# Altium schematic sheet Encoder.SchDoc: Encoder Expansion Board
size Letter; Engineer: Will Knutson; Revision: A; SheetNumber: 1; SheetTotal: 1; ProjectGroup: Severson Group; ProjectOrganization: WEMPEC; ProjectUniversity: UW-Madison; ProjectRev: A
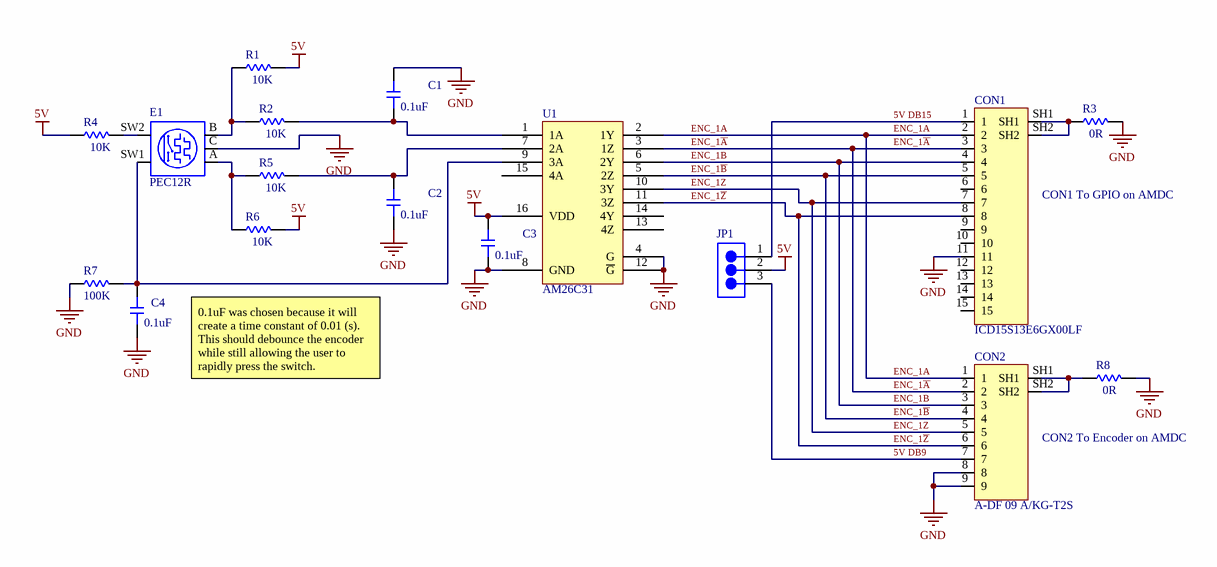
[diagram p0: Encoder.SchDoc]

## Parts
C1  Capacitor 0.1uF  [.1uF Capacitor (0603-CAP)]  (value not drawn)
C2  Capacitor 0.1uF  [.1uF Capacitor (0603-CAP)]  (value not drawn)
C3  Capacitor 0.1uF  [.1uF Capacitor (0603-CAP)]  (value not drawn)
C4  Capacitor 0.1uF  [.1uF Capacitor (0603-CAP)]  (value not drawn)
CON1  ICD15S13E6GX00LF  [ICD15S]
CON2  A-DF 09 A/KG-T2S  [DB9 Connector]
E1  PEC12R  [Encoder]
JP1  Jumper3  [PIN_HEADER_1X3]  (value not drawn)
R1  Resistor  [10K Resistor (0603-RES)]  (value not drawn)
R2  Resistor  [10K Resistor (0603-RES)]  (value not drawn)
R3  Resistor  [0 Resistor (1206-RES)]  (value not drawn)
R4  Resistor  [10K Resistor (0603-RES)]  (value not drawn)
R5  Resistor  [10K Resistor (0603-RES)]  (value not drawn)
R6  Resistor  [10K Resistor (0603-RES)]  (value not drawn)
R7  Resistor  [100K Resistor (0603-RES)]  (value not drawn)
R8  Resistor  [0 Resistor (1206-RES)]  (value not drawn)
U1  AM26C31  [AM26C31]

## Nets
5V: C3.1 JP1.2 R1.2 R4.1 R6.2 U1.16(VDD)
GND: C1.1 C2.2 C3.2 C4.2 CON1.11 CON2.8 CON2.9 E1.C R3.2 R7.1 R8.2 U1.4(G) U1.8(GND) U1.12(~{G})
5V DB9: CON2.7 JP1.3
5V DB15: CON1.1 JP1.1
ENC_1A: CON1.2 CON2.1 U1.2(1Y)
ENC_1~{A}: CON1.3 CON2.2 U1.3(1Z)
ENC_1B: CON1.4 CON2.3 U1.6(2Y)
ENC_1~{B}: CON1.5 CON2.4 U1.5(2Z)
ENC_1Z: CON1.7 CON2.5 U1.10(3Y)
ENC_1~{Z}: CON1.8 CON2.6 U1.11(3Z)
NetC1_2: C1.2 R2.2 U1.1(1A)
NetC2_1: C2.1 R5.2 U1.7(2A)
NetC4_1: C4.1 E1.SW1 R7.2 U1.9(3A)
NetCON1_SH1: CON1.SH1 CON1.SH2 R3.1
NetCON2_SH1: CON2.SH1 CON2.SH2 R8.1
NetE1_A: E1.A R5.1 R6.1
NetE1_B: E1.B R1.1 R2.1
NetE1_SW2: E1.SW2 R4.2

Not connected (* = marked no-connect by the designer): CON1 6 9 10 12 13 14 15; U1 13(4Z) 14(4Y) 15(4A)

## Notes on the sheet
- (near CON1) CON1 To GPIO on AMDC
- 0.1uF was chosen because it will create a time constant of 0.01 (s). This should debounce the encoder while still allowing the user to rapidly press the switch.
- (near CON2) CON2 To Encoder on AMDC
- Title:
- File:
- Sheet:
- of
- Revision:
- Time:
- Date:
- Engineer:
- (in symbol Capacitor 0.1uF) 0.1uF
- (in symbol Resistor 0R) 0R
- (in symbol Resistor 10K) 10K
- (in symbol Resistor 100K) 100K

## Library data of the parts
C1-C4 = Capacitor 0.1uF: Capacitor; Supplier 1: Digi-Key; Supplier Part Number 1: 1276-1012-1-ND
CON1 = ICD15S13E6GX00LF: CONN D-SUB PLUG 15POS R/A SLDR; Supplier 1: Digi-Key; Supplier Part Number 1: 609-2801-ND
CON2 = DB9 Connector A-DF_09_A/KG-T2S: 9 Position D-Sub Receptacle, Female Sockets Connector; MF: Assmann WSW; SnapEDA_Link: https://www.snapeda.com/parts/A-DF%2009%20A/KG-T2S/Assmann%20WSW%20Components/view-part/2761262/?ref=snap; Availability: Unavailable; MP: A-DF 09 A/KG-T2S; Check_prices: https://www.snapeda.com/parts/A-DF%2009%20A/KG-T2S/Assmann%20WSW%20Components/view-part/2761262/?ref=eda; Price: None; Value: *; Package: None; Supplier 1: Digi-Key; Supplier Part Number 1: AE10921-ND
E1 = PEC12R-4220F-S0024: Supplier 1: Digi-Key; Supplier Part Number 1: PEC12R-4220F-S0024-ND
R1 R2 R4-R6 = Resistor 10K: Supplier 1: Digi-Key; Supplier Part Number 1: P10.0KHCT-ND
R3 R8 = Resistor 0R: Supplier 1: Digi-Key; Supplier Part Number 1: 311-0.0ERCT-ND
R7 = Resistor 100K: Supplier 1: Digi-Key; Supplier Part Number 1: 311-100KLDCT-ND
U1 = AM26C31: IC DRIVER 4/0 16TSSOP; Supplier 1: Digi-Key; Supplier Part Number 1: 296-30087-1-ND
JP1 = Jumper3: Supplier 1: Digi-Key; Supplier Part Number 1: 732-5316-ND